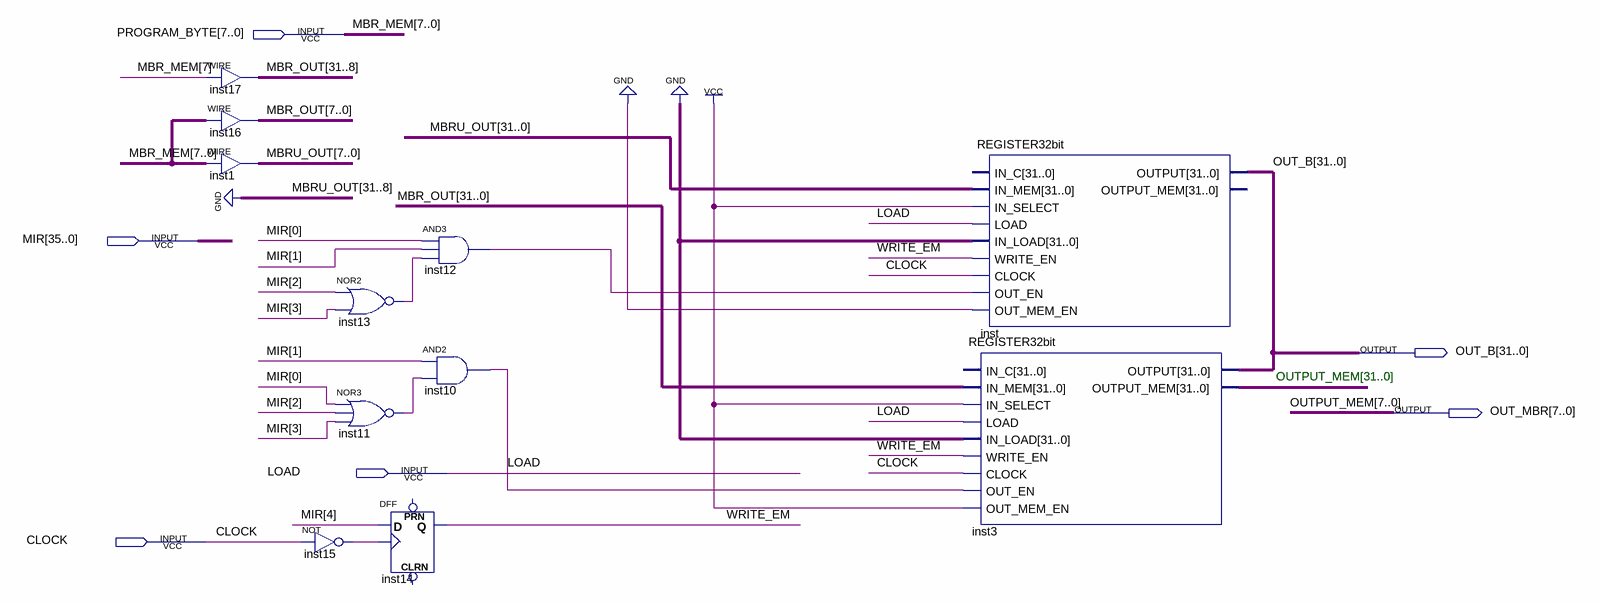
[diagram p0: schematic sheet]
// Quartus schematic MBR.bdf as structural Verilog: 11 symbols, 6 pins
module MBR (
  input  [7:0] PROGRAM_BYTE,
  input  [35:0] MIR,
  input  LOAD,
  input  CLOCK,
  output [31:0] OUT_B,
  output [7:0] OUT_MBR
);

  wire inst10_out, inst11_out, inst12_out, inst13_out, inst15_out, WRITE_EM;
  wire [7:0] MBRU_OUT;
  wire [31:0] MBR_OUT;
  wire [31:8] OUTPUT_MEM;

  assign MBR_OUT[31:8] = {24{PROGRAM_BYTE[7]}};  // WIRE inst17
  assign MBR_OUT[7:0] = PROGRAM_BYTE;  // WIRE inst16
  assign MBRU_OUT = PROGRAM_BYTE;  // WIRE inst1
  not inst15 (inst15_out, CLOCK);
  nor inst13 (inst13_out, MIR[2], MIR[3]);
  nor inst11 (inst11_out, MIR[0], MIR[2], MIR[3]);
  and inst12 (inst12_out, MIR[0], MIR[1], inst13_out);
  and inst10 (inst10_out, MIR[1], inst11_out);
  DFF inst14 (.CLK(inst15_out), .D(MIR[4]), .Q(WRITE_EM));  // open: CLRN, PRN
  REGISTER32bit inst (
    .IN_MEM({{24{1'b0}}, MBRU_OUT}), .IN_SELECT(1'b1), .LOAD(LOAD), .IN_LOAD({32{1'b0}}),
    .WRITE_EN(WRITE_EM), .CLOCK(CLOCK), .OUT_EN(inst12_out), .OUT_MEM_EN(1'b0), .OUTPUT(OUT_B));  // open: IN_C, OUTPUT_MEM
  REGISTER32bit inst3 (
    .IN_MEM(MBR_OUT), .IN_SELECT(1'b1), .LOAD(LOAD), .IN_LOAD({32{1'b0}}), .WRITE_EN(WRITE_EM),
    .CLOCK(CLOCK), .OUT_EN(inst10_out), .OUT_MEM_EN(1'b1), .OUTPUT(OUT_B), .OUTPUT_MEM({OUTPUT_MEM, OUT_MBR}));  // open: IN_C

  // Other names for the same wires on the sheet: MBR_MEM[7:0] = PROGRAM_BYTE; OUTPUT_MEM[7:0] = OUT_MBR

  // Notes on the sheet:
  //   OUTPUT_MEM[31..0]
endmodule
